# EasyEDA Pro project AD8367可变增益放大器.eprj

# Schematic SCH_AD8367可变增益放大器
Board Name: Board1; Create Date: 2025-01-09; Page Name: P1; Project Name: AD8367可变增益放大器; Schematic Name: SCH_AD8367可变增益放大器; Update Date: 2025-02-19; Company: 深圳嘉立创科技集团股份有限公司; Drawed: LCEDA_02; Page Size: A5; Part Number: JLC-PCB-001; Reviewed: 嘉立创EDA; Version: V1.0
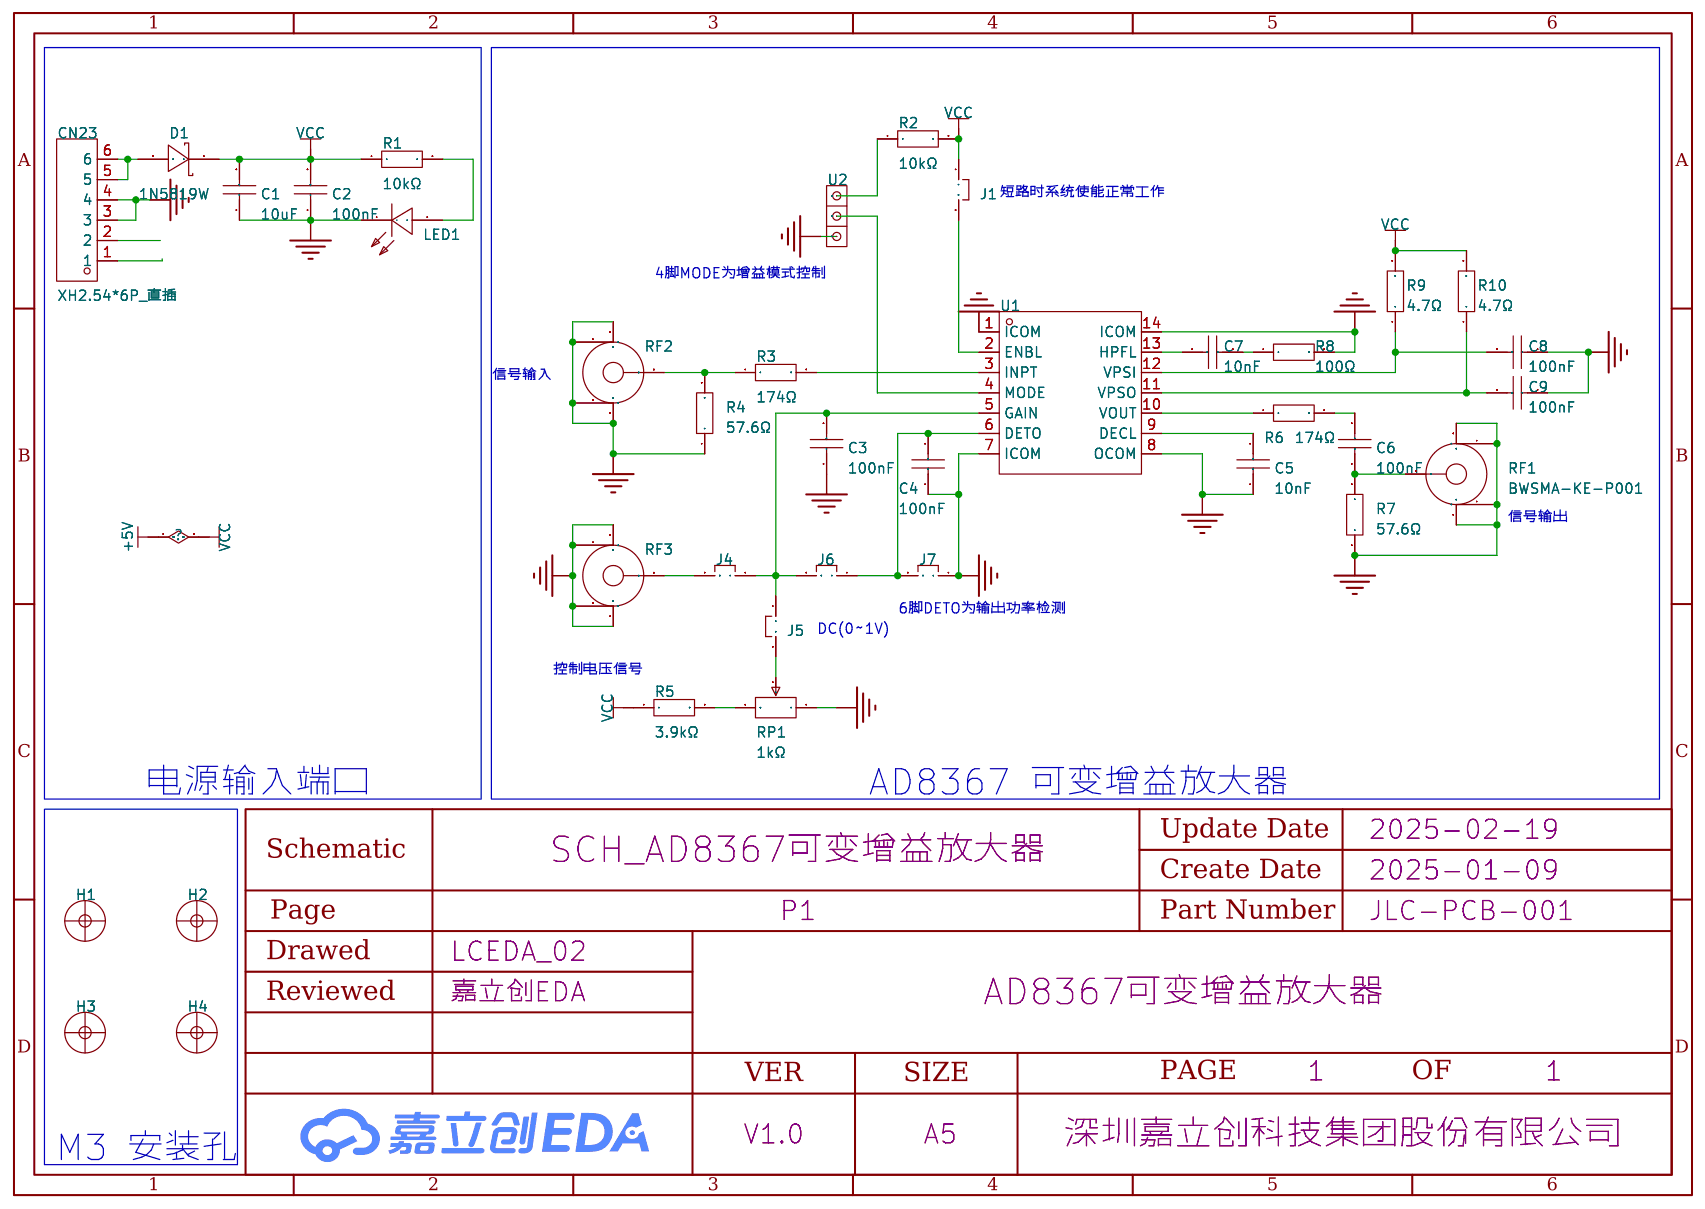
[diagram p0: schematic sheet]

## Parts
C1  10uF  [R0805]
C2  100nF  [R0805]
C3  100nF  [R0805]
C4  100nF  [R0805]
C5  10nF  [R0805]
C6  100nF  [R0805]
C7  10nF  [R0805]
C8  100nF  [R0805]
C9  100nF  [R0805]
CN23  XH2.54*6P_直插  [CONN-TH_XH2.54-6P]
D1  1N5819W  [SOD-123F_L2.8-W1.8-LS3.7-RD]
H1  -  [M3]
H2  -  [M3]
H3  -  [M3]
H4  -  [M3]
J1  PZ254V-11-02P  [HDR-TH_2P-P2.54-V-M]
J4  PZ254V-11-02P  [HDR-TH_2P-P2.54-V-M]
J5  PZ254V-11-02P  [HDR-TH_2P-P2.54-V-M]
J6  PZ254V-11-02P  [HDR-TH_2P-P2.54-V-M]
J7  PZ254V-11-02P  [HDR-TH_2P-P2.54-V-M]
LED1  NCD0805R1  [LED0805-RD_RED]
R1  10kΩ  [R0805]
R2  10kΩ  [R0805]
R3  174Ω  [R0805]
R4  57.6Ω  [R0805]
R5  3.9kΩ  [R0805]
R6  174Ω  [R0805]
R7  57.6Ω  [R0805]
R8  100Ω  [R0805]
R9  4.7Ω  [R0805]
R10  4.7Ω  [R0805]
RF1  BWSMA-KE-P001  [SMA-SMD_BWSMA-KE-P001]
RF2  BWSMA-KE-P001  [SMA-SMD_BWSMA-KE-P001]
RF3  BWSMA-KE-P001  [SMA-SMD_BWSMA-KE-P001]
RP1  1kΩ  [RES-ADJ-TH_3P-L10.0-W10.0-P2.50-BL-BS]
U1  AD8367ARUZ-RL7  [TSSOP-14_L5.0-W4.4-P0.65-LS6.4-BL]
U2  -  [1*3跳线]

## Library data of the parts
C1 = CL21A106KAYNNNE_C15850: 容值:10uF;精度:±10%;额定电压:25V;材质(温度系数):X5R;; LCSC Part Name: 10uF ±10% 25V; Supplier Part: C15850; Manufacturer: SAMSUNG(三星); Manufacturer Part: CL21A106KAYNNNE; Supplier Footprint: 0805; JLCPCB Part Class: 基础库; Datasheet: https://atta.szlcsc.com/upload/public/pdf/source/20160103/1457707679302.pdf; Supplier: LCSC; Tolerance: ±10%; Voltage Rated: 25V; Temperature Coefficient: X5R
C2-C4 C6 C8 C9 = CL21B104KCFNNNE: 容值:100nF;精度:±10%;额定电压:100V;材质(温度系数):X7R;; LCSC Part Name: 100nF ±10% 100V; Supplier Part: C28233; Manufacturer: SAMSUNG(三星); Supplier Footprint: 0805; JLCPCB Part Class: Basic Part; Datasheet: https://atta.szlcsc.com/upload/public/pdf/source/20160103/1457707716102.pdf; Supplier: LCSC; Tolerance: ±10%; Voltage Rated: 100V; Temperature Coefficient: X7R
C5 C7 = CL21B103KBANNNC: 容值:10nF;精度:±10%;额定电压:50V;材质(温度系数):X7R;; LCSC Part Name: 10nF ±10% 50V; Supplier Part: C1710; Manufacturer: SAMSUNG(三星); Supplier Footprint: 0805; JLCPCB Part Class: Basic Part; Datasheet: https://atta.szlcsc.com/upload/public/pdf/source/20160103/1457707693082.pdf; Supplier: LCSC; Tolerance: ±10%; Voltage Rated: 50V; Temperature Coefficient: X7R
CN23 = XH2.54*6P_直插: Supplier Part: C9900008614; Supplier Footprint: XH2.54_6P; JLCPCB Part Class: 扩展库; Supplier: LCSC
D1 = 1N5819W_C169540: 直流反向耐压(Vr):40V;平均整流电流(Io):1A;正向压降(Vf):600mV@1A;; LCSC Part Name: 40V 1A 600mV@1A; Supplier Part: C169540; Manufacturer: 晶导微电子; Supplier Footprint: SOD-123F; JLCPCB Part Class: Extended Part; Datasheet: https://atta.szlcsc.com/upload/public/pdf/source/20180316/CADAC6127F7EB1C6F7CC209B8BEF97B8.pdf; Supplier: LCSC; Reverse Voltage (Vr): 40V; Average Rectified Current (Io): 1A; Forward Voltage (Vf@If): 600mV@1A
H1-H4 = M3: Manufacturer: Shuntian(顺天五金); Manufacturer Part: M3x10+6; Supplier Part: C551322; Supplier: LCSC; JLCPCB Part Class: 扩展库
J1 J4-J7 = PZ254V-11-02P: 排数:单排;总PIN位数:2;间距:2.54mm;插针结构:1x2P;行距:-;安装类型:直插;圆针/方针:方针;额定电流:-;额定电压:-;配合针长度:6mm;塑高:2.5mm;端接针长度:3mm;触头材质:黄铜;触头镀层:-;工作温度范围:-40℃~+105℃;颜色:黑色;; LCSC Part Name: 2.54mm 1x2P 直插 方针; Supplier Part: C492401; Manufacturer: XFCN(兴飞); Supplier Footprint: 直插,P=2.54mm; JLCPCB Part Class: Extended Part; Datasheet: https://atta.szlcsc.com/upload/public/pdf/source/20200309/C492401_A812433581A9B211A7FFA413ADDFF0E5.pdf; Supplier: LCSC; Number of Rows: 单排; Number of Pins: 2; Pitch: 2.54mm; Pin Structure: 1x2P; Mounting Type: 直插; Circluar Pins/Square Pins: 方针; Length of Mating Pin: 6mm; Insulation Height: 2.5mm; Length of End Connection Pin: 3mm; Contact Material: 黄铜; Operating Temperature Range: -40℃~+105℃; Color: 黑色
LED1 = NCD0805R1: 发光颜色:红灯;; LCSC Part Name: 红灯; Supplier Part: C84256; Manufacturer: 国星光电; Supplier Footprint: 0805; JLCPCB Part Class: Basic Part; Datasheet: https://atta.szlcsc.com/upload/public/pdf/source/20200820/C84256_F0A75A43B3EAD75808600A0514C76B99.pdf; Supplier: LCSC; Emitted Color: 红灯
R1 R2 = 0805W8F1002T5E_C17414: 电阻类型:厚膜电阻;阻值:10kΩ;精度:±1%;功率:125mW;; LCSC Part Name: 10kΩ ±1% 125mW; Supplier Part: C17414; Manufacturer: UNI-ROYAL(厚声); Manufacturer Part: 0805W8F1002T5E; Supplier Footprint: 0805; JLCPCB Part Class: Basic Part; Datasheet: https://atta.szlcsc.com/upload/public/pdf/source/20200306/C422600_1E6D84923E4A46A82E41ADD87F860B5C.pdf; Supplier: LCSC; Type: 厚膜电阻; Tolerance: ±1%; Power(Watts): 125mW; Temperature Coefficient: ±100ppm/℃; Overload Voltage (Max): 150V; Operating Temperature Range: -55℃~+155℃
R3 R6 = 0805W8F1740T5E: 电阻类型:厚膜电阻;阻值:174Ω;精度:±1%;功率:125mW;; LCSC Part Name: 174Ω ±1% 125mW; Supplier Part: C17494; Manufacturer: UNI-ROYAL(厚声); Supplier Footprint: 0805; JLCPCB Part Class: Extended Part; Datasheet: https://atta.szlcsc.com/upload/public/pdf/source/20200306/C422600_1E6D84923E4A46A82E41ADD87F860B5C.pdf; Supplier: LCSC; Type: 厚膜电阻; Tolerance: ±1%; Power(Watts): 125mW; Temperature Coefficient: ±100ppm/℃; Overload Voltage (Max): 150V; Operating Temperature Range: -55℃~+155℃
R4 R7 = 0805W8F576JT5E: 电阻类型:厚膜电阻;阻值:57.6Ω;精度:±1%;功率:125mW;; LCSC Part Name: 57.6Ω ±1% 125mW; Supplier Part: C17759; Manufacturer: UNI-ROYAL(厚声); Supplier Footprint: 0805; JLCPCB Part Class: Extended Part; Datasheet: https://atta.szlcsc.com/upload/public/pdf/source/20200306/C422600_1E6D84923E4A46A82E41ADD87F860B5C.pdf; Supplier: LCSC; Type: 厚膜电阻; Tolerance: ±1%; Power(Watts): 125mW; Temperature Coefficient: ±100ppm/℃; Overload Voltage (Max): 150V; Operating Temperature Range: -55℃~+155℃
R5 = 0805W8F3901T5E: 电阻类型:厚膜电阻;阻值:3.9kΩ;精度:±1%;功率:125mW;; LCSC Part Name: 3.9kΩ ±1% 125mW; Supplier Part: C17614; Manufacturer: UNI-ROYAL(厚声); Supplier Footprint: 0805; JLCPCB Part Class: Basic Part; Datasheet: https://atta.szlcsc.com/upload/public/pdf/source/20200306/C422600_1E6D84923E4A46A82E41ADD87F860B5C.pdf; Supplier: LCSC; Type: 厚膜电阻; Tolerance: ±1%; Power(Watts): 125mW; Temperature Coefficient: ±100ppm/℃; Overload Voltage (Max): 150V; Operating Temperature Range: -55℃~+155℃
R8 = 0805W8F1000T5E: 电阻类型:厚膜电阻;阻值:100Ω;精度:±1%;功率:125mW;; LCSC Part Name: 100Ω ±1% 125mW; Supplier Part: C17408; Manufacturer: UNI-ROYAL(厚声); Supplier Footprint: 0805; JLCPCB Part Class: Basic Part; Datasheet: https://atta.szlcsc.com/upload/public/pdf/source/20200306/C422600_1E6D84923E4A46A82E41ADD87F860B5C.pdf; Supplier: LCSC; Type: 厚膜电阻; Tolerance: ±1%; Power(Watts): 125mW; Temperature Coefficient: ±100ppm/℃; Overload Voltage (Max): 150V; Operating Temperature Range: -55℃~+155℃
R9 R10 = 0805W8F470KT5E: 电阻类型:厚膜电阻;阻值:4.7Ω;精度:±1%;功率:125mW;; LCSC Part Name: 4.7Ω ±1% 125mW; Supplier Part: C17675; Manufacturer: UNI-ROYAL(厚声); Supplier Footprint: 0805; JLCPCB Part Class: Basic Part; Datasheet: https://atta.szlcsc.com/upload/public/pdf/source/20200306/C422600_1E6D84923E4A46A82E41ADD87F860B5C.pdf; Supplier: LCSC; Type: 厚膜电阻; Tolerance: ±1%; Power(Watts): 125mW; Temperature Coefficient: ±200ppm/℃; Overload Voltage (Max): 150V; Operating Temperature Range: -55℃~+155℃
RF1-RF3 = BWSMA-KE-P001: 连接器类型:板端;射频系列:SMA;接口类型:内孔;端口数量:1;阻抗:50Ω;频率-最大值:12.4GHz;样式:偏脚;接口直径:5.2mm;接口长度/高度:-;工作温度范围:-;; LCSC Part Name: SMA 内孔 偏脚 SMA偏脚板端座子; Supplier Part: C496550; Manufacturer: BAT WIRELESS(蝙蝠无线); Supplier Footprint: 插件; JLCPCB Part Class: Extended Part; Datasheet: https://atta.szlcsc.com/upload/public/pdf/source/20200416/C496550_06668BF2E3B968EA39F96D17E7156373.pdf; Supplier: LCSC; Connector Type: 板端; RF Series: SMA; Interface Type: 内孔; Number of Ports: 1; Impedance: 50Ω; Frequency-Max: 12.4GHz; Style: 偏脚; Interface Diameter: 5.2mm
RP1 = 3296W-1-102: 阻值:1kΩ;精度:±10%;; LCSC Part Name: 1kΩ ±10%; Supplier Part: C118949; Manufacturer: BOCHEN(博晨); Supplier Footprint: 插件; JLCPCB Part Class: Extended Part; Datasheet: https://atta.szlcsc.com/upload/public/pdf/source/20171114/C118949_15106326635991117438.pdf; Supplier: LCSC; Tolerance: ±10%
U1 = AD8367ARUZ-RL7: Supplier Part: C191561; Manufacturer: ADI(亚德诺)/LINEAR(凌特); Supplier Footprint: TSSOP-14; JLCPCB Part Class: Extended Part; Datasheet: https://atta.szlcsc.com/upload/public/pdf/source/20200408/C191561_25904AF254F64640D2A0ECFC6C3DB0D9.pdf; Supplier: LCSC
U2 = 1*3跳线

## Nets
+5V: C1.2 C2.2 D1.1 J1.1 R1.1 R2.2 R5.1 R9.2 R10.2
GND: C1.1 C2.1 C3.1 C4.1 C5.1 C8.1 C9.1 CN23.3 CN23.4 J7.1 LED1.1(-) R4.1 R7.1 R8.2 RF1.1 RF1.2 RF1.3 RF1.4 RF2.1 RF2.2 RF2.3 RF2.4 RF3.1 RF3.2 RF3.3 RF3.4 RP1.1 U1.1(ICOM) U1.7(ICOM) U1.8(OCOM) U1.14(ICOM) U2.1
$1N102: CN23.5 CN23.6 D1.2
$1N421: LED1.2(+) R1.2
$1N2312: R2.1 U2.3
$1N2724: J1.2 U1.2(ENBL)
$1N2736: U1.4(MODE) U2.2
$1N2808: R3.2 U1.3(INPT)
$1N2928: R3.1 R4.2 RF2.5
$1N3107: J4.2 RF3.5
$1N3282: C4.2 J6.1 J7.2 U1.6(DETO)
$1N3379: J5.2 RP1.2
$1N3504: R5.2 RP1.3
$1N3677: C5.2 U1.9(DECL)
$1N3748: R6.1 U1.10(VOUT)
$1N3782: C6.2 R6.2
$1N3860: C6.1 R7.2 RF1.5
$1N3993: C7.1 R8.1
$1N4004: C7.2 U1.13(HPFL)
$1N4203: C8.2 R9.1 U1.12(VPSI)
$1N4210: C9.2 R10.1 U1.11(VPSO)
$1N12080: C3.2 J4.1 J5.1 J6.2 U1.5(GAIN)

Not connected (* = marked no-connect by the designer): CN23 1 2

## Notes on the sheet
- 短路时系统使能正常工作
- 4脚MODE为增益模式控制
- 信号输入
- 信号输出
- 6脚DETO为输出功率检测
- DC(0～1V)
- 控制电压信号
- 电源输入端口
- AD8367 可变增益放大器
- M3 安装孔

# Board PCB_AD8367可变增益放大器
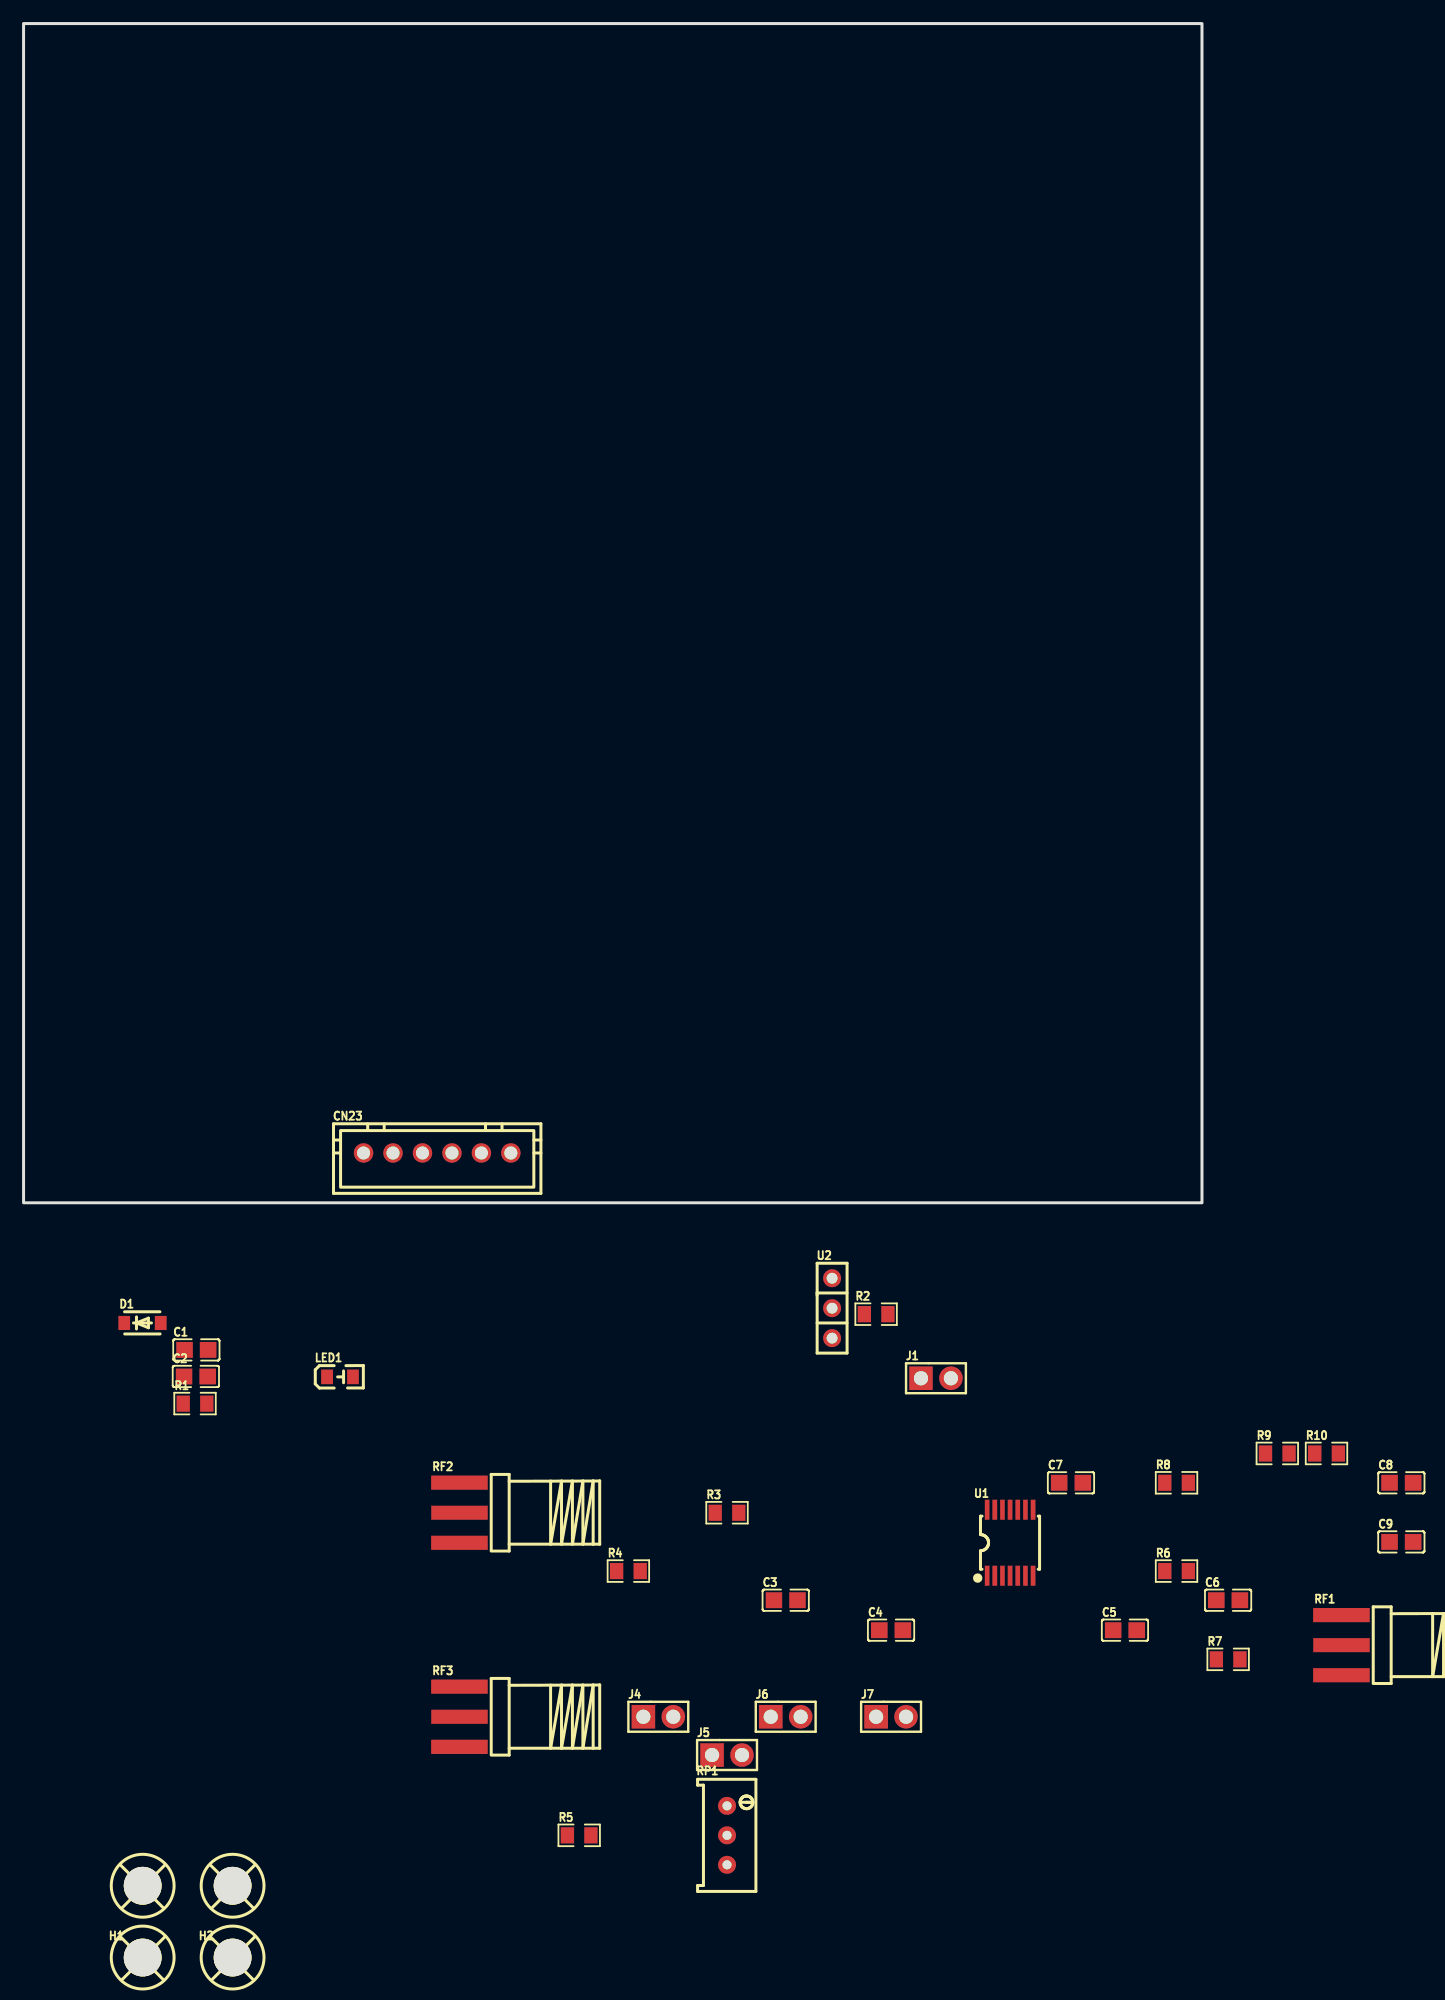
[diagram p1: board, top side]
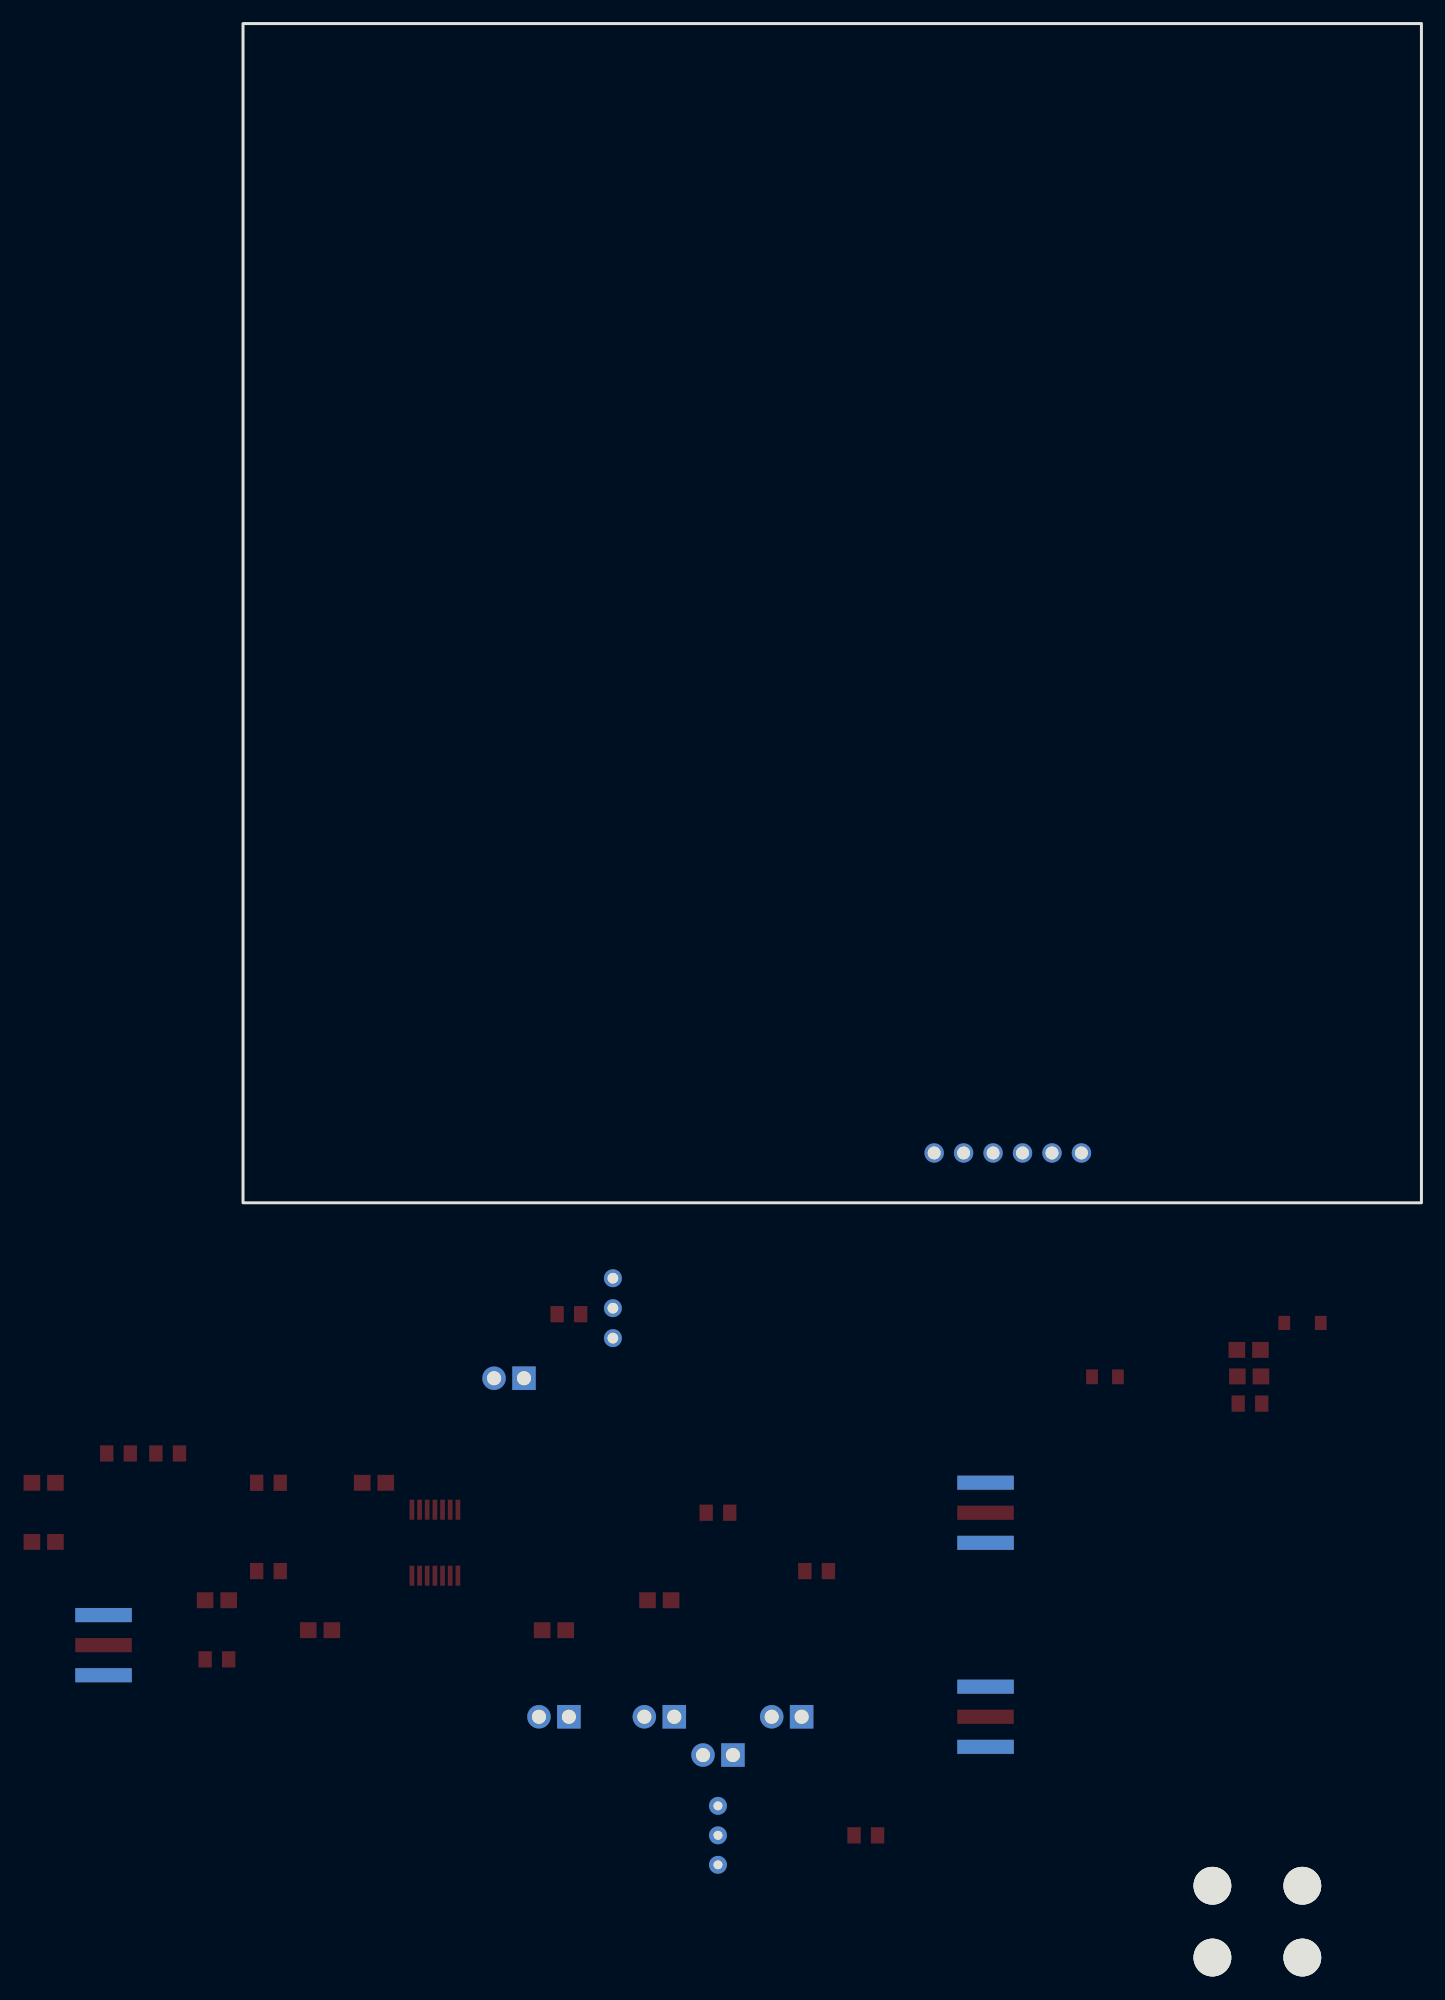
[diagram p2: board, bottom side, seen from below]

Outline 100 x 100 mm; copper layers: Top Layer, Bottom Layer. Coordinates in mm from the lower left corner of the outline.
Outline path: rectangle 0,100 100,0
Stack: Top Layer 0.035mm / Dielectric1 1.51mm FR4 er 4.5 / Bottom Layer 0.035mm

## Design rules (mm)
template: JLCPCB Capability(Two Layers Board)
spacing copperThickness1oz (default): track to track 0.102, other pairs 0.152 to 0.3
spacing copperThickness2oz: track to track 0.203, other pairs 0.152 to 0.3
track width copperThickness1oz (default): min 0.127, default 0.254, max 2.54
track width copperThickness2oz: min 0.203, default 0.254, max 2.54
differential pair differentialPair (default): width min 0.127, default 0.254, max 2.54; gap min 0.152, default 0.152
via viaSize (default): diameter min 0.5, default 0.61, max 10; hole min 0.3, default 0.305, max 6.3

## Placement (name value [footprint] x y rotation side)
C1  10uF  [C0805]  14.66 -12.47 0 top
C2  100nF  [C0805]  14.62 -14.72 0 top
C3  100nF  [C0805]  64.68 -33.7 0 top
C4  100nF  [C0805]  73.62 -36.24 0 top
C5  10nF  [C0805]  93.46 -36.24 0 top
C6  100nF  [C0805]  102.22 -33.7 0 top
C7  10nF  [C0805]  88.88 -23.74 0 top
C8  100nF  [C0805]  116.92 -23.74 0 top
C9  100nF  [C0805]  116.92 -28.76 0 top
CN23  XH2.54*6P_直插  [CONN-TH_XH2.54-6P]  35.1 4.22 0 top
D1  1N5819W  [SOD-123F_L2.8-W1.8-LS3.7-RD]  10.09 -10.19 0 top
H1  -  [M3]  9.94 -57.93 0 top
H2  -  [M3]  17.57 -57.93 0 top
H3  -  [M3]  9.94 -64.02 0 top
H4  -  [M3]  17.57 -64.02 0 top
J1  PZ254V-11-02P  [HDR-TH_2P-P2.54-V-M]  77.43 -14.88 0 top
J4  PZ254V-11-02P  [HDR-TH_2P-P2.54-V-M]  53.87 -43.59 0 top
J5  PZ254V-11-02P  [HDR-TH_2P-P2.54-V-M]  59.7 -46.83 0 top
J6  PZ254V-11-02P  [HDR-TH_2P-P2.54-V-M]  64.68 -43.59 0 top
J7  PZ254V-11-02P  [HDR-TH_2P-P2.54-V-M]  73.62 -43.59 0 top
LED1  NCD0805R1  [LED0805-RD_RED]  26.85 -14.76 0 top
R1  10kΩ  [R0805]  14.55 -17.03 0 top
R2  10kΩ  [R0805]  72.35 -9.44 0 top
R3  174Ω  [R0805]  59.7 -26.28 0 top
R4  57.6Ω  [R0805]  51.32 -31.23 0 top
R5  3.9kΩ  [R0805]  47.15 -53.64 0 top
R6  174Ω  [R0805]  97.84 -31.23 0 top
R7  57.6Ω  [R0805]  102.22 -38.72 0 top
R8  100Ω  [R0805]  97.84 -23.74 0 top
R9  4.7Ω  [R0805]  106.39 -21.26 0 top
R10  4.7Ω  [R0805]  110.57 -21.26 0 top
RF1  BWSMA-KE-P001  [SMA-SMD_BWSMA-KE-P001]  111.84 -37.51 0 top
RF2  BWSMA-KE-P001  [SMA-SMD_BWSMA-KE-P001]  36.99 -26.28 0 top
RF3  BWSMA-KE-P001  [SMA-SMD_BWSMA-KE-P001]  36.99 -43.59 0 top
RP1  1kΩ  [RES-ADJ-TH_3P-L10.0-W10.0-P2.50-BL-BS]  59.7 -53.64 0 top
U1  AD8367ARUZ-RL7  [TSSOP-14_L5.0-W4.4-P0.65-LS6.4-BL]  83.72 -28.82 0 top
U2  -  [1*3跳线]  68.61 -11.48 0 top

## Footprints (pads in the part's own frame, mm; a bottom-side part is the same pattern mirrored in y, then rotated)
1*3跳线
  round 1.524 hole 0.914: 1(0,5.08) 2(0,2.54) 3(0,0)
C0805
  rect 1.41x1.35 smd: 1(-1,0) 2(1,0)
CONN-TH_XH2.54-6P
  round 1.65 hole 1.1: 1(-6.25,0) 2(-3.75,0) 3(-1.25,0) 4(1.25,0) 5(3.75,0) 6(6.25,0)
HDR-TH_2P-P2.54-V-M
  rect 2x2 hole 1.2: 1(-1.27,0)
  round 2 hole 1.2: 2(1.27,0)
LED0805-RD_RED
  rect 1x1.25 smd: 1(-1.1,0) 2(1.1,0)
M3
  round 3.2 hole 3.2: 1(0.165,0.013)
R0805
  rect 1.133x1.377 smd: 1(-1,0) 2(1,0)
RES-ADJ-TH_3P-L10.0-W10.0-P2.50-BL-BS
  round 1.524 hole 0.762: 1(0,2.5) 2(0,0) 3(0,-2.5)
SMA-SMD_BWSMA-KE-P001
  rect 4.8x1.2 smd: 1(0,-2.55) 2(0,2.55) 5(0,0)
  rect 4.8x1.2 smd far side: 3(0,2.55) 4(0,-2.55)
SOD-123F_L2.8-W1.8-LS3.7-RD
  rect 1x1.2 smd: 1(-1.55,0) 2(1.55,0)
TSSOP-14_L5.0-W4.4-P0.65-LS6.4-BL
  rect 0.4x1.7 smd: 1(-1.95,-2.8) 2(-1.3,-2.8) 3(-0.65,-2.8) 4(0,-2.8) 5(0.65,-2.8) 6(1.3,-2.8) 7(1.95,-2.8) 8(1.95,2.8) 9(1.3,2.8) 10(0.65,2.8) 11(0,2.8) 12(-0.65,2.8) 13(-1.3,2.8) 14(-1.95,2.8)

## Nets
As in the schematic.

Pads without a net: H1 1; H2 1; H3 1; H4 1
